# Altium schematic sheet Schematic(Altium).schdoc
size 307 x 210 mm
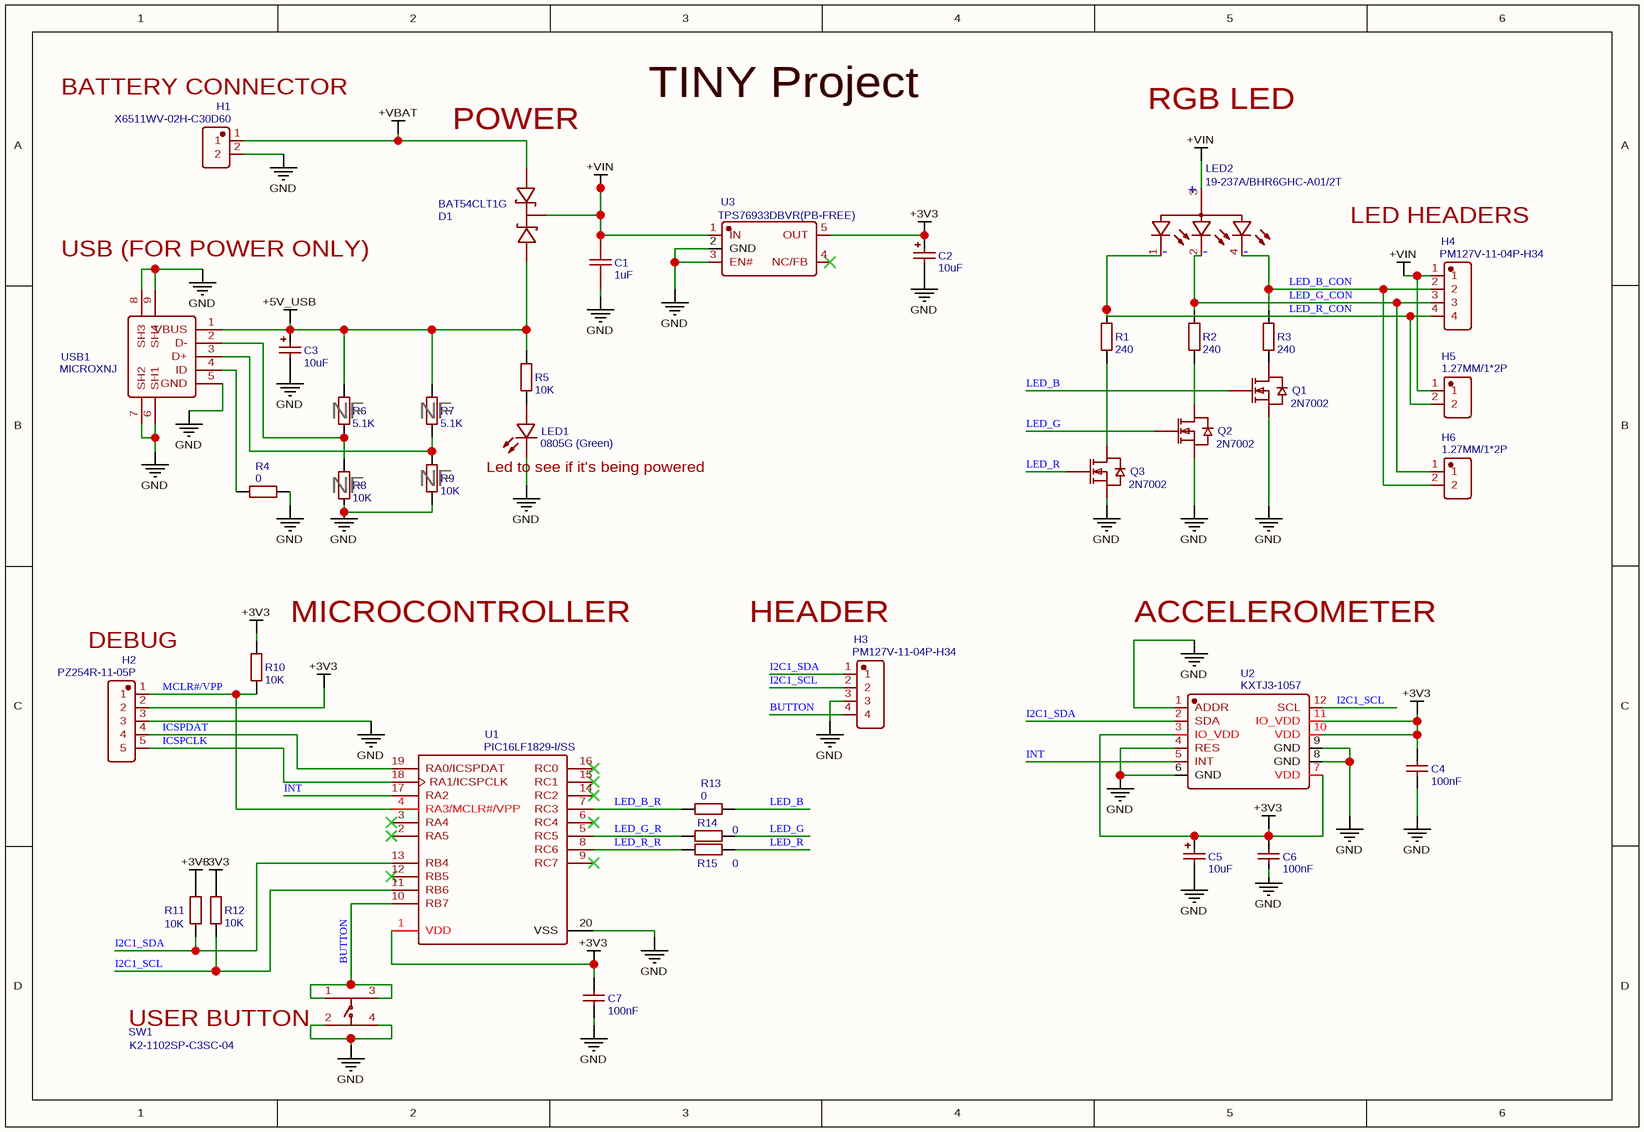
[diagram p0: Schematic(Altium).schdoc]

## Parts
C1  1uF  [C0402]
C2  10uF  [CAP-SMD_L3.2-W1.6-R-RD]
C3  10uF  [CAP-SMD_L3.2-W1.6-R-RD]
C4  100nF  [C0402_NEW]
C5  10uF  [CAP-SMD_L3.2-W1.6-R-RD]
C6  100nF  [C0402_NEW]
C7  100nF  [C0402_NEW]
D1  BAT54CLT1G  [SOT-23-3_L2.9-W1.6-P1.90-LS2.8-BR]
H1  X6511WV-02H-C30D60  [HDR-TH_2P-P2.54-V-M]
H2  PZ254R-11-05P  [HDR-TH_5P-P2.54-H-M-W10.4]
H3  PM127V-11-04P-H34  [HDR-TH_4P-P1.27-V-F]
H4  PM127V-11-04P-H34  [HDR-TH_4P-P1.27-V-F]
H5  1.27MM/1*2P  [HDR-TH_2P-P1.27-V-M]
H6  1.27MM/1*2P  [HDR-TH_2P-P1.27-V-M]
LED1  0805G (Green)  [LED0805-RD]
LED2  19-237A/BHR6GHC-A01/2T  [LED-SMD_4P-L1.6-W1.6-BR-RD]
Q1  2N7002  [SOT-23-3_L2.9-W1.3-P1.90-LS2.4-BR]
Q2  2N7002  [SOT-23-3_L2.9-W1.3-P1.90-LS2.4-BR]
Q3  2N7002  [SOT-23-3_L2.9-W1.3-P1.90-LS2.4-BR]
R1  240  [R0402]
R2  240  [R0402]
R3  240  [R0402]
R4  0  [R0402]
R5  10K  [R0402]
R6  5.1K  [R0402]
R7  5.1K  [R0402]
R8  10K  [R0402]
R9  10K  [R0402]
R10  10K  [R0402]
R11  10K  [R0402]
R12  10K  [R0402]
R13  0  [R0402]
R14  0  [R0402]
R15  0  [R0402]
SW1  K2-1102SP-C3SC-04  [SW-SMD_4P-L6.0-W6.0-P4.50-LS9.0]
U1  PIC16LF1829-I/SS  [SSOP-20_L7.2-W5.3-P0.65-LS7.8-BL]
U2  KXTJ3-1057  [LGA-12_L2.0-W2.0-P0.50-BL]
U3  TPS76933DBVR(PB-FREE)  [SOT-23-5_L3.0-W1.7-P0.95-LS2.8-BR]
USB1  MICROXNJ  [MICRO-USB-SMD_MICROXNJ]

## Nets
+3V3: C2.1 C4.2 C5.1 C6.2 C7.2 H2.2 R10.2 R11.2 R12.2 U1.1(VDD) U2.3(IO_VDD) U2.7(VDD) U2.10(VDD) U2.11(IO_VDD) U3.5(OUT)
+5V_USB: C3.1 D1.2(A) R5.2 R6.2 R7.2 USB1.1(VBUS)
+VBAT: D1.1(A) H1.1
+VIN: C1.2 D1.3(K) H4.1 H5.1 LED2.3 U3.1(IN)
GND: C1.1 C2.2 C3.2 C4.1 C5.2 C6.1 C7.1 H1.2 H2.3 H3.3 LED1.1(K) Q1.2(S) Q2.2(S) Q3.2(S) R4.2 R8.1 R9.1 SW1.2 SW1.4 U1.20(VSS) U2.1(ADDR) U2.4(RES) U2.6(GND) U2.8(GND) U2.9(GND) U3.2(GND) U3.3(EN#) USB1.5(GND) USB1.6(SH1) USB1.7(SH2) USB1.8(SH3) USB1.9(SH4)
BUTTON: H3.4 SW1.1 SW1.3 U1.10(RB7)
I2C1_SCL: H3.2 R12.1 U1.11(RB6) U2.12(SCL)
I2C1_SDA: H3.1 R11.1 U1.13(RB4) U2.2(SDA)
ICSPCLK: H2.5 U1.18(RA1/ICSPCLK)
ICSPDAT: H2.4 U1.19(RA0/ICSPDAT)
INT: U1.17(RA2) U2.5(INT)
LED_B: Q1.1(G) R13.2
LED_B_CON: H4.2 H6.2 LED2.4 R3.2
LED_B_R: R13.1 U1.7(RC3)
LED_G: Q2.1(G) R14.2
LED_G_CON: H4.3 H6.1 LED2.2 R2.2
LED_G_R: R14.1 U1.5(RC5)
LED_R: Q3.1(G) R15.2
LED_R_CON: H4.4 H5.2 LED2.1 R1.2
LED_R_R: R15.1 U1.8(RC6)
MCLR#/VPP: H2.1 R10.1 U1.4(RA3/MCLR#/VPP)
NetLED1_2: LED1.2(A) R5.1
NetQ1_3: Q1.3(D) R3.1
NetQ2_3: Q2.3(D) R2.1
NetQ3_3: Q3.3(D) R1.1
NetR4_1: R4.1 USB1.4(ID)
NetR6_1: R6.1 R8.2 USB1.2(D-)
NetR7_1: R7.1 R9.2 USB1.3(D+)

Not connected (* = marked no-connect by the designer): U1 2(RA5)* 3(RA4)* 6(RC4)* 9(RC7)* 12(RB5)* 14(RC2)* 15(RC1)* 16(RC0)*; U3 4(NC/FB)*

## Notes on the sheet
- (near H1) BATTERY CONNECTOR
- (near D1) POWER
- TINY Project
- RGB LED
- USB (FOR POWER ONLY)
- (near H4) LED HEADERS
- (near R6) NF
- (near R7) NF
- (near LED1) Led to see if it's being powered
- (near R8) NF
- (near R9) NF
- (near H2) DEBUG
- (near R10) MICROCONTROLLER
- (near H3) HEADER
- ACCELEROMETER
- USER BUTTON
- (in symbol 19-237A/BHR6GHC-A01/2T) +; -

## Library data of the parts
C1 = 1uF: BOM_Manufacturer: SAMSUNG; BOM_Manufacturer Part: CL05A105KA5NQNC; nameAlias: Capacitance; BOM_Supplier: LCSC; BOM_Supplier Part: C52923; BOM_JLCPCB Part Class: Basic Part; spicePre: C; spiceSymbolName: CL05A105KA5NQNC
C2 C3 C5 = 10uF: BOM_Manufacturer: AVX; BOM_Manufacturer Part: TAJA106K016RNJ; nameAlias: Capacitance; BOM_Supplier: LCSC; BOM_Supplier Part: C7171; BOM_JLCPCB Part Class: Basic Part; spicePre: C; spiceSymbolName: TAJA106K016RNJ
C4 C6 C7 = 100nF: BOM_Manufacturer Part: CL05B104KO5NNNC; BOM_Manufacturer: SAMSUNG; nameAlias: Capacitance; BOM_Supplier: LCSC; BOM_Supplier Part: C1525; BOM_JLCPCB Part Class: Basic Part; spicePre: C; spiceSymbolName: CL05B104KO5NNNC
D1 = BAT54CLT1G: BOM_Manufacturer: ON; BOM_Supplier: LCSC; BOM_Manufacturer Part: BAT54CLT1G; BOM_Supplier Part: C14308; BOM_JLCPCB Part Class: Extended Part; spicePre: D; spiceSymbolName: BAT54CLT1G
H1 = X6511WV-02H-C30D60: BOM_Manufacturer: XKB Connectivity; Contributor: LCSC; BOM_Supplier: LCSC; BOM_Supplier Part: C706874; BOM_Manufacturer Part: X6511WV-02H-C30D60; BOM_JLCPCB Part Class: Extended Part; spicePre: H; spiceSymbolName: X6511WV-02H-C30D60
H2 = PZ254R-11-05P: BOM_Manufacturer: XFCN; Contributor: LCSC; BOM_Supplier: LCSC; BOM_Supplier Part: C492413; BOM_Manufacturer Part: PZ254R-11-05P; BOM_JLCPCB Part Class: Extended Part; spicePre: H; spiceSymbolName: PZ254R-11-05P
H3 H4 = PM127V-11-04P-H34: BOM_Manufacturer: XFCN; Contributor: LCSC; BOM_Supplier: LCSC; BOM_Supplier Part: C492398; BOM_Manufacturer Part: PM127V-11-04P-H34; BOM_JLCPCB Part Class: Extended Part; spicePre: H; spiceSymbolName: PM127V-11-04P-H34
H5 H6 = 1.27MM/1*2P: BOM_Manufacturer: BOOMELE(Boom Precision Elec); Contributor: LCSC; BOM_Supplier: LCSC; BOM_Supplier Part: C703015; BOM_Manufacturer Part: 1.27mm/1*2P; BOM_JLCPCB Part Class: Extended Part; spicePre: H; spiceSymbolName: 1.27MM/1*2P
LED1 = 0805G (Green): BOM_Manufacturer: KENTO; BOM_Supplier: LCSC; BOM_Manufacturer Part: 0805G (Green); BOM_Supplier Part: C2297; BOM_JLCPCB Part Class: Basic Part; spicePre: L; spiceSymbolName: 0805G (Green)
LED2 = 19-237A/BHR6GHC-A01/2T: BOM_Manufacturer: Everlight Elec; Contributor: LCSC; BOM_Supplier: LCSC; BOM_Supplier Part: C114830; BOM_Manufacturer Part: 19-237A/BHR6GHC-A01/2T; BOM_JLCPCB Part Class: Extended Part; spicePre: L; spiceSymbolName: 19-237A/BHR6GHC-A01/2T
Q1-Q3 = 2N7002: BOM_Manufacturer: CJ; BOM_Supplier: LCSC; BOM_Manufacturer Part: 2N7002; BOM_Supplier Part: C8545; BOM_JLCPCB Part Class: Basic Part; spicePre: Q; spiceSymbolName: 2N7002
R1-R3 = 240: BOM_Manufacturer: UniOhm; BOM_Manufacturer Part: 0402WGF2400TCE; nameAlias: Resistance (Ohms); BOM_Supplier: LCSC; BOM_Supplier Part: C25094; BOM_JLCPCB Part Class: Extended Part; spicePre: R; spiceSymbolName: 0402WGF2400TCE
R4 R13-R15 = 0: BOM_Manufacturer: UniOhm; BOM_Manufacturer Part: 0402WGF0000TCE; nameAlias: Resistance (Ohms); BOM_Supplier: LCSC; BOM_Supplier Part: C17168; BOM_JLCPCB Part Class: Basic Part; spicePre: R; spiceSymbolName: 0402WGF0000TCE
R5 R8-R12 = 10K: BOM_Manufacturer: UniOhm; BOM_Manufacturer Part: 0402WGF1002TCE; nameAlias: Resistance (Ohms); BOM_Supplier: LCSC; BOM_Supplier Part: C25744; BOM_JLCPCB Part Class: Basic Part; spicePre: R; spiceSymbolName: 0402WGF1002TCE
R6 R7 = 5.1K: BOM_Manufacturer: UniOhm; BOM_Manufacturer Part: 0402WGF5101TCE; nameAlias: Resistance (Ohms); BOM_Supplier: LCSC; BOM_Supplier Part: C25905; BOM_JLCPCB Part Class: Basic Part; spicePre: R; spiceSymbolName: 0402WGF5101TCE
SW1 = K2-1102SP-C3SC-04: BOM_Manufacturer: Korean Hroparts Elec; Contributor: LCSC; BOM_Supplier: LCSC; BOM_Supplier Part: C707347; BOM_Manufacturer Part: K2-1102SP-C3SC-04; BOM_JLCPCB Part Class: Extended Part; spicePre: S; spiceSymbolName: K2-1102SP-C3SC-04
U1 = PIC16LF1829-I/SS: BOM_Manufacturer: MICROCHIP; BOM_Supplier: LCSC; BOM_Manufacturer Part: PIC16LF1829-I/SS; BOM_Supplier Part: C59149; BOM_JLCPCB Part Class: Extended Part; spicePre: U; spiceSymbolName: PIC16LF1829-I/SS
U2 = KXTJ3-1057: BOM_Manufacturer: ROHM Semicon; Contributor: LCSC; BOM_Supplier: LCSC; BOM_Supplier Part: C442603; BOM_Manufacturer Part: KXTJ3-1057; BOM_JLCPCB Part Class: Extended Part; spicePre: U; spiceSymbolName: KXTJ3-1057
U3 = TPS76933DBVR(PB-FREE): BOM_Manufacturer: TI; BOM_Supplier: LCSC; BOM_Manufacturer Part: TPS76933DBVR(PB-FREE); BOM_Supplier Part: C7101; BOM_JLCPCB Part Class: Extended Part; spicePre: U; spiceSymbolName: TPS76933DBVR(PB-FREE)
USB1 = MICROXNJ: BOM_Manufacturer: SHOU HAN; Contributor: LCSC; BOM_Supplier: LCSC; BOM_Supplier Part: C404969; BOM_Manufacturer Part: MicroXNJ; BOM_JLCPCB Part Class: Extended Part; spicePre: U; spiceSymbolName: MICROXNJ